# EAGLE design RSP antithept (EAGLE 7.6.0)
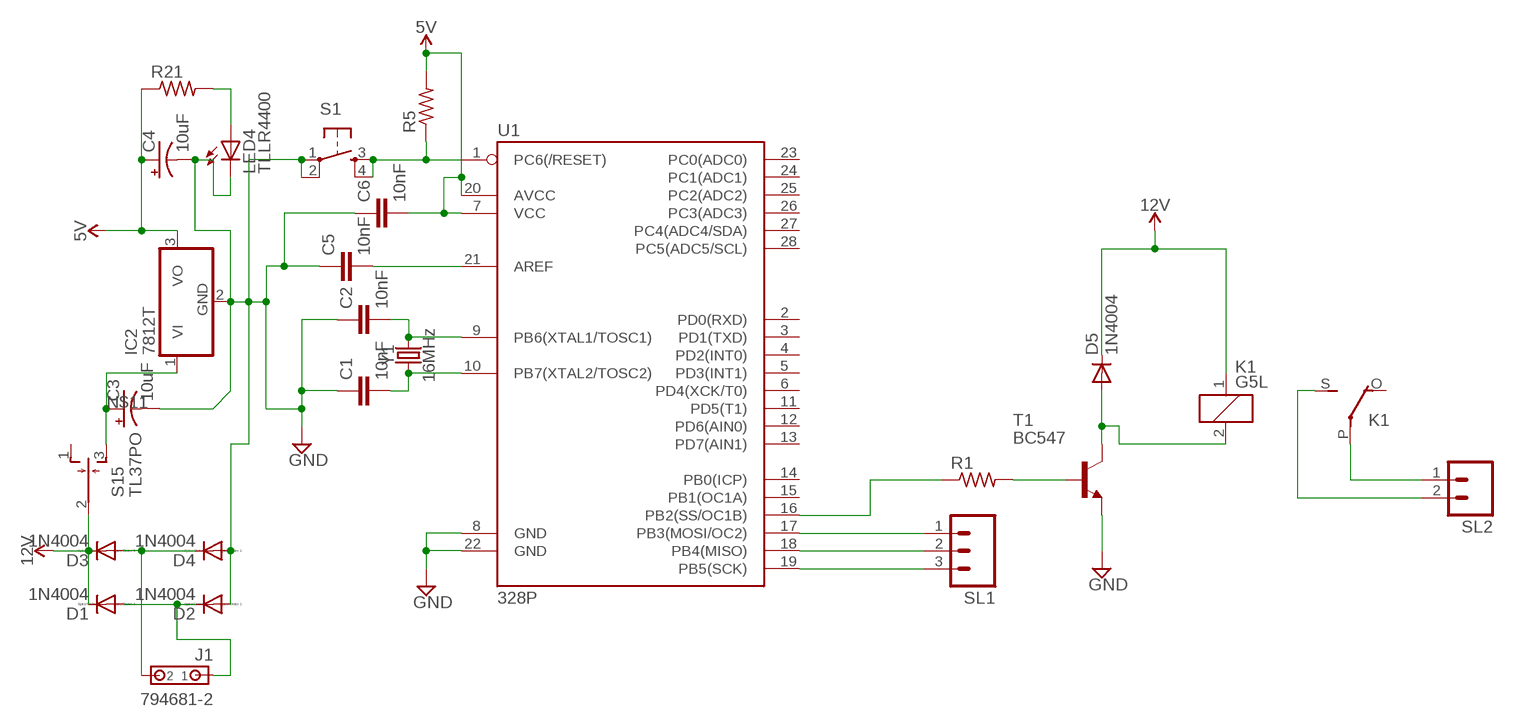
[diagram p0: schematic, sheet 1]

## Parts
C1  10nF  10NF-PTH-10MM-10000V-1-%  [CAP-PTH-10MM]
C2  10nF  10NF-PTH-10MM-10000V-1-%  [CAP-PTH-10MM]
C3  10uF  10UF-POLAR-RADIAL-2.5MM-KIT-25V-20%  [CPOL-RADIAL-2.5MM-5MM-KIT]
C4  10uF  10UF-POLAR-RADIAL-2.5MM-KIT-25V-20%  [CPOL-RADIAL-2.5MM-5MM-KIT]
C5  10nF  10NF-PTH-10MM-10000V-1-%  [CAP-PTH-10MM]
C6  10nF  10NF-PTH-10MM-10000V-1-%  [CAP-PTH-10MM]
D1  1N4004  [DO41-10]
D2  1N4004  [DO41-10]
D3  1N4004  [DO41-10]
D4  1N4004  [DO41-10]
D5  1N4004  [DO41-10]
IC2  7812T  [TO220H]
J1  794681-2  [794681-2]
K1  G5L  [G5LE]
LED4  TLLR4400  [LED3MM]
R1  R-US_0207/9  [0207/9]
R5  R-US_0207/12  [0207/12]
R21  R-US_0207/12  [0207/12]
S1  TAC_SWITCHPTH  [TACTILE-PTH]
S15  TL37PO  [TL3XPO]
SL1  MA03  [03P]
SL2  MA02  [02PA]
T1  BC547  [TO92]
U1  328P  ATMEGA328P_PDIP  [DIP28]
Y1  16MHz  CRYSTAL-16MHZPTH-HC49US  [HC49US]

## Nets
5V: C4.1(+) C6.2 IC2.3(VO) R5.2 R21.1 U1.7(VCC) U1.20(AVCC)
12V: D1.C D3.C D5.C K1.1 S15.2(P)
GND: C1.1 C2.1 C3.2(-) C4.2(-) C5.1 C6.1 D2.A D4.A IC2.2(GND) LED4.K(C) S1.1 S1.2 T1.1(E) U1.8(GND) U1.22(GND)
N$1: SL1.1 U1.17(PB3(MOSI/OC2))
N$2: SL1.2 U1.18(PB4(MISO))
N$3: C2.2 U1.9(PB6(XTAL1/TOSC1)) Y1.2
N$4: C1.2 U1.10(PB7(XTAL2/TOSC2)) Y1.1
N$5: LED4.A R21.2
N$6: C5.2 U1.21(AREF)
N$7: SL1.3 U1.19(PB5(SCK))
N$8: R1.1 U1.16(PB2(SS/OC1B))
N$9: R5.1 S1.3 S1.4 U1.1(PC6(/RESET))
N$10: D3.A D4.C J1.2
N$11: C3.1(+) IC2.1(VI) S15.3(S)
N$12: R1.2 T1.2(B)
N$13: D5.A K1.2 T1.3(C)
N$14: K1.S(2:S) SL2.2
N$15: K1.P(2:P) SL2.1
N$50: D1.A D2.C J1.1
Unconnected: K1.O(2:O) S15.1(O) U1.2(PD0(RXD)) U1.3(PD1(TXD)) U1.4(PD2(INT0)) U1.5(PD3(INT1)) U1.6(PD4(XCK/T0)) U1.11(PD5(T1)) U1.12(PD6(AIN0)) U1.13(PD7(AIN1)) U1.14(PB0(ICP)) U1.15(PB1(OC1A)) U1.23(PC0(ADC0)) U1.24(PC1(ADC1)) U1.25(PC2(ADC2)) U1.26(PC3(ADC3)) U1.27(PC4(ADC4/SDA)) U1.28(PC5(ADC5/SCL))

## Library data of the parts
C1 C2 C5 C6 = SparkFun-Capacitors:10NF: 0.01uF/10nF/10,000pF ceramic capacitors A capacitor is a passive two-terminal electrical component used to store electrical energy temporarily in an electric field. CAP-09321; PROD_ID: CAP-09321
C3 C4 = SparkFun-Capacitors:10UF-POLAR: 10.0µF polarized capacitors A capacitor is a passive two-terminal electrical component used to store electrical energy temporarily in an electric field.; PROD_ID: CAP-08440
D1-D4 = diode:1N4004: DIODE general purpose rectifier, 1 A
D5 = diode-1:1N4004: DIODE general purpose rectifier, 1 A
IC2 = linear:78*: Positive VOLTAGE REGULATOR Source: http://cache.national.com/ds/LM/LM78L05.pdf http://www.fairchildsemi.com/ds/LM/LM7805.pdf
J1 = con-amp:794681-2: Micro MATE-N-LOK Connectors grid 1.5mm Dual Row Through Hole Vertical Metal Through Hole Holddowns Source: ENG_CD_794681_E.pdf
K1 = relay:G5L: RELAY 1 x switch, 10 A/120 V AC, 8 A/30 V ADC, Omron; OC_FARNELL: unknown; OC_NEWARK: unknown
LED4 = led:TLLR4400: Low Current (2mA) LED 3 mm Tinted Diffused Package color RED Source: Data sheet <http://www.farnell.com/datasheets/391100.pdf>; MF: VISHAY SEMICONDUCTOR; OC_FARNELL: 1612437
R1 = adafruit:R-US_: RESISTOR, American symbol
R5 R21 = rcl:R-US_: RESISTOR, American symbol
S1 = SparkFun-Retired:TAC_SWITCH: Momentary Switch Button commonly used for reset or general input. Spark Fun Electronics SKU : COM-00097 SMT- SWCH-08247
S15 = switch:TL37PO: TINY SWITCH MOM OFF MOM Source: http://www2.produktinfo.conrad.com/datenblaetter/700000-724999/705152-da-01-de-Subminiaturschalter_TL_36YO.pdf
SL1 = con-amp-quick:MA03: AMP QUICK CONNECTOR; OC_FARNELL: unknown; OC_NEWARK: unknown
SL2 = con-amp-quick:MA02: AMP QUICK CONNECTOR; OC_FARNELL: unknown; OC_NEWARK: unknown
T1 = transistor:BC547: NPN TRANSISTOR
U1 = SparkFun-IC-Microcontroller:ATMEGA328P_PDIP: Atmel 328P Through hole ATMEGA328P uC used in the Arduino 32kb flash, 1k EEPROM, 2k SRAM Datasheet <http://www.sparkfun.com/datasheets/Components/SMD/ATMega328.pdf> SparkFun Products Storefront component: AVR 28 Pin 20MHz 32K 6A/D - ATMega328P <https://www.sparkfun.com/products/9061> (COM-09061) SparkFun Simon Says - Through-Hole Soldering Kit <https://www.sparkfun.com/products/10547> (KIT-10547) SparkFun Learn to Solder - Simon Says <https://www.sparkfun.com/products/13708> (KIT-13708) SparkFun BigTime Watch Kit <https://www.sparkfun.com/products/11734> (KIT-11734) SparkFun ClockIt <https://www.sparkfun.com/products/10930> (KIT-10930) SparkFun Serial Enabled LCD Kit <https://www.sparkfun.com/products/10097> (LCD-10097) SparkFun Simon Tilts - Through Hole Soldering Kit <https://www.sparkfun.com/products/12634> (KIT-12634) SparkFun Frequency Counter Kit <https://www.sparkfun.com/products/10140> (KIT-10140) FabFM Radio Kit <https://www.sparkfun.com/products/11043> (KIT-11043) SparkFun Binary Blaster Kit <https://www.sparkfun.com/products/12037> (KIT-12037) SparkFun Metro-Gnome <https://www.sparkfun.com/products/9236> (KIT-09236) ATmega328 with Arduino Optiboot (Uno) <https://www.sparkfun.com/products/10524> (DEV-10524); PROD_ID: IC-09136
Y1 = SparkFun-Clocks:CRYSTAL-16MHZ: 16MHz Crystal Digikey Example <http://www.digikey.com/product-search/en?keywords=535-9122-1-ND> Frequency: 16MHz Frequency Stability: ±50ppm Frequency Tolerance: ±20ppm Load Capacitance: 18pF SparkFun Products: Pro Micro -5V/16MHz <https://www.sparkfun.com/products/12640> SparkFun Serial Enabled LCD Kit <https://www.sparkfun.com/products/10097>; PROD_ID: XTAL-08181; SF_ID: COM-00536

## Board
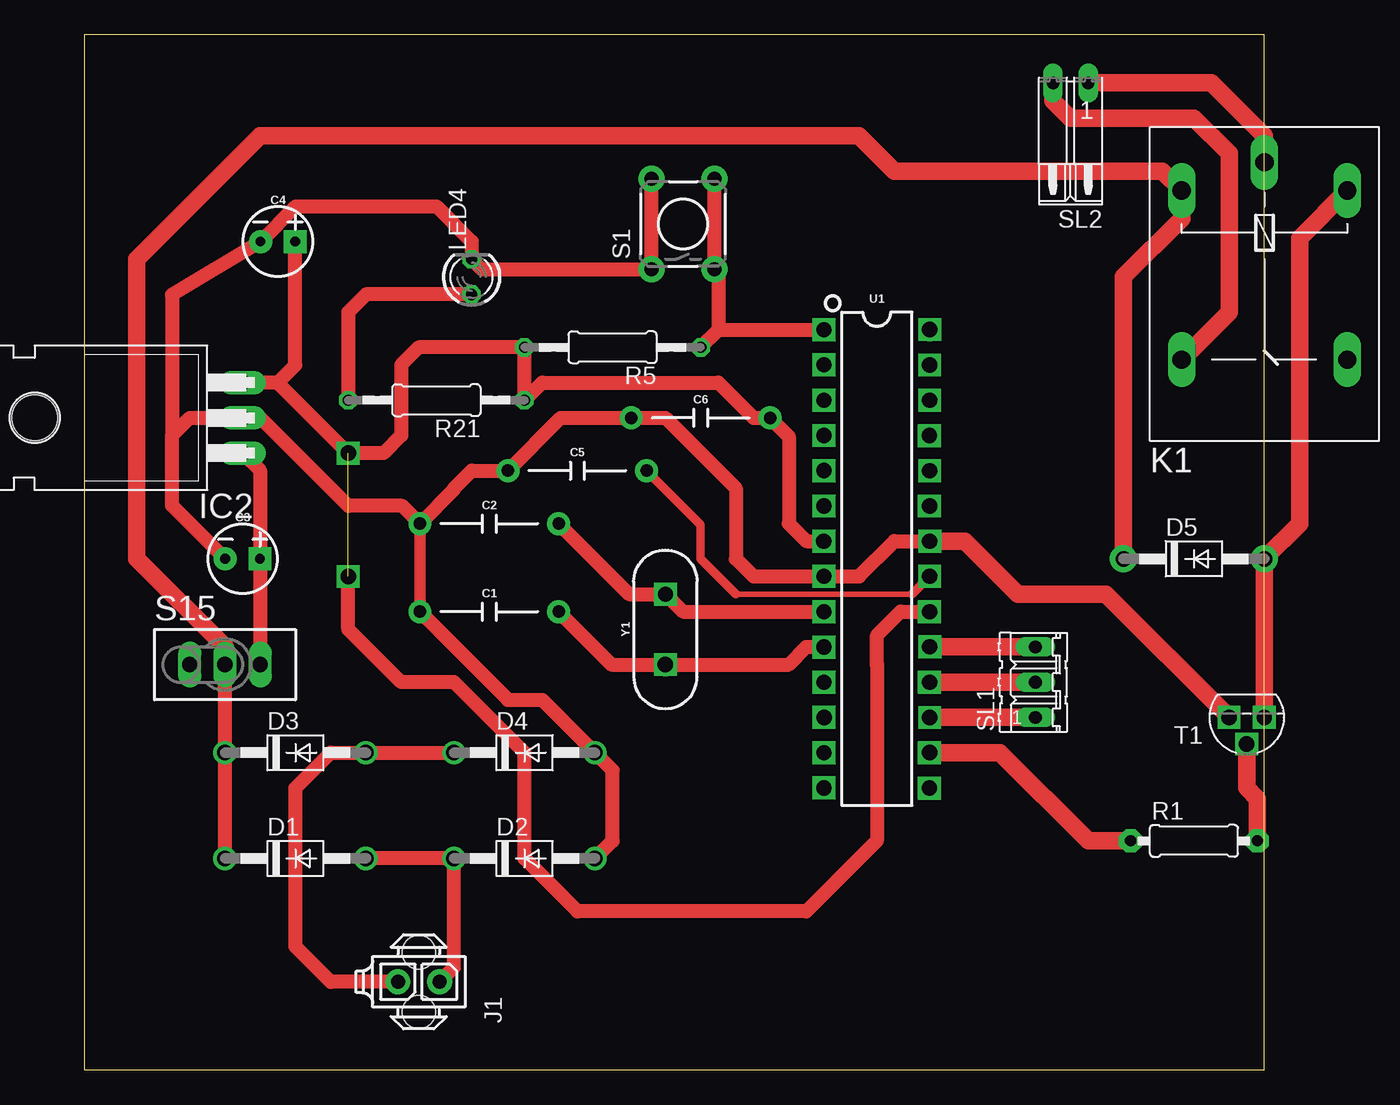
[diagram p1: board, top side]

Size 85.07 x 74.6 mm. Coordinates in mm from the lower left corner, seen from the top.
Outline: 0,0 85.07,0 85.07,74.6 0,74.6 0,0
Copper layers (1*16): Top 0.035mm / dielectric 1.5mm / Bottom 0.035mm
Design rules "default": minimum track width 10mil, minimum drill 24mil, track to track 8mil, track to pad 8mil, pad to pad 8mil, via to via 8mil, smd to smd 8mil, copper to edge 40mil, drill to drill 8mil, minimum pad ring 10mil, minimum via ring 8mil, stop-mask expansion 4mil, vias tented up to drill 0mil, thermal gap 10mil

### Footprints (pad centres in the part's own frame; a part is rotated, then mirrored left to right if it is on the bottom)
CAP-PTH-10MM = drill 0.9 pad 1.651: 1 -5,0; 2 5,0
CPOL-RADIAL-2.5MM-5MM-KIT = drill 0.7 pad 1.651 square: 1 1.25,0 | drill 0.7 pad 1.651: 2 -1.25,0
DO41-10 = drill 1.118: A 5.08,0; C -5.08,0
DO41-10' = drill 1.118 pad 1.93: A 5.08,0; C -5.08,0
TO220H = drill 1.118 long: 1 -2.54,-10.16; 2 0,-10.16; 3 2.54,-10.16 | hole 3.302: 0,4.826
794681-2 = drill 1 pad 1.778: 1 0,-1.5; 2 0,1.5 | hole 2.4: 2.13,0; -2.17,0
G5LE = drill 1.321 long: 1 -7.493,-5.969; 2 -7.493,5.969; O 4.699,5.969; P -9.525,0; S 4.699,-5.969
LED3MM = drill 0.813 octagon: A -1.27,0; K 1.27,0
0207/9 = drill 0.813 pad 1.676 octagon: 1 -4.572,0; 2 4.572,0
0207/12 = drill 0.813 octagon: 1 -6.35,0; 2 6.35,0
TACTILE-PTH = drill 1.016 pad 1.88: 1 -3.251,2.261; 2 3.251,2.261; 3 -3.251,-2.261; 4 3.251,-2.261
TL3XPO = drill 1.1 pad 1.422 long: 1 -2.54,0; 2 0,0; 3 2.54,0
03P = drill 0.914 long: 1 -2.54,0; 2 0,0; 3 2.54,0
02PA = drill 0.914 long: 1 -1.27,0; 2 1.27,0
TO92 = drill 0.813 octagon: 1 1.27,0; 2 0,1.905; 3 -1.27,0
DIP28 = drill 0.813 pad 1.626: 1 -16.51,-3.81; 2 -13.97,-3.81; 3 -11.43,-3.81; 4 -8.89,-3.81; 5 -6.35,-3.81; 6 -3.81,-3.81; 7 -1.27,-3.81; 8 1.27,-3.81; 9 3.81,-3.81; 10 6.35,-3.81; 11 8.89,-3.81; 12 11.43,-3.81; 13 13.97,-3.81; 14 16.51,-3.81; 15 16.51,3.81; 16 13.97,3.81; 17 11.43,3.81; 18 8.89,3.81; 19 6.35,3.81; 20 3.81,3.81; 21 1.27,3.81; 22 -1.27,3.81; 23 -3.81,3.81; 24 -6.35,3.81; 25 -8.89,3.81; 26 -11.43,3.81; 27 -13.97,3.81; 28 -16.51,3.81
HC49US = drill 0.7 pad 1.651: 1 -2.54,0; 2 2.54,0

### Placement (x,y rotation side)
C1  29.21,33.02 0 top
C2  29.21,39.37 0 top
C3  11.43,36.83 0 top
C4  13.97,59.69 0 top
C5  35.56,43.18 0 top
C6  44.45,46.99 0 top
D1  15.24,15.24 0 top
D2  31.75,15.24 0 top
D3  15.24,22.86 0 top
D4  31.75,22.86 0 top
D5  1N4004  [DO41-10']  80.01,36.83 0 top
IC2  1.27,46.99 90 top
J1  24.13,6.35 90 top
K1  85.09,55.88 270 top
LED4  27.94,57.15 90 top
R1  80.01,16.51 0 top
R5  38.1,52.07 180 top
R21  25.4,48.26 180 top
S1  43.18,60.96 90 top
S15  10.16,29.21 0 top
SL1  68.58,27.94 90 top
SL2  71.12,71.12 180 top
T1  83.82,25.4 180 top
U1  57.15,36.83 270 top
Y1  41.91,31.75 90 top

### Tracks (layer width: path | path; a pad name or v marks a point on that pad's centre or on a via)
5V  (via drill 1.1)  (1 unrouted)
  Top 1.016: U1.7 52.07,38.1 50.8,39.37 50.8,45.64 C6.2 48.26,46.99 45.72,49.53 33.02,49.53 R21.1 R5.2 24.13,52.07 22.86,50.8 22.86,45.72 21.59,44.45 v19.05,44.45 13.97,49.53 | 13.97,49.53 IC2.3 | 13.97,49.53 15.22,50.78 C4.1 | v19.05,35.56 19.05,31.75 22.86,27.94 26.67,27.94 31.75,22.86 31.75,15.24 35.56,11.43 52.07,11.43 57.15,16.51 57.15,29.21 57.16,29.22 57.16,31.32 58.86,33.02 U1.20
12V
  Top 1.016: D1.C D3.C S15.2
  Top 1.27: D5.C 74.93,57.15 79.12,61.34 K1.1 77.72,64.77 58.42,64.77 55.88,67.31 12.7,67.31 3.81,58.42 3.81,36.83 10.16,30.48 S15.2
GND
  Top 0.813: C1.1 C2.1
  Top 1.016: C3.2 6.35,40.66 6.35,45.72 | 6.35,45.72 7.62,46.99 IC2.2 12.7,46.99 19.05,40.64 22.94,40.64 C2.1 26.67,41.83 26.67,41.91 27.94,43.18 C5.1 34.37,46.99 C6.1 41.91,46.99 46.99,41.91 46.99,36.83 48.26,35.56 U1.8 55.88,35.56 58.42,38.1 U1.22 | 6.35,45.72 6.35,55.86 C4.2 15.26,62.23 25.4,62.23 27.94,59.69 LED4.K 28.65,57.71 S1.1 S1.2 | D2.A 38.1,16.51 38.1,21.59 D4.A 33.02,26.67 30.56,26.67 C1.1
  Top 1.27: T1.1 73.66,34.29 67.31,34.29 63.5,38.1 U1.22
N$1
  Top 1.27: U1.17 SL1.1
N$2
  Top 1.27: SL1.2 U1.18
N$3
  Top 1.016: C2.2 39.29,34.29 Y1.2 43.18,33.02 U1.9
N$4
  Top 1.016: U1.10 52.07,30.48 50.8,29.21 Y1.1 38.02,29.21 C1.2
N$5
  Top 1.016: LED4.A 20.32,55.88 19.05,54.61 R21.2
N$6
  Top 0.406: 46.99,34.29 59.69,34.29
  Top 0.61: C5.2 44.45,39.29 44.45,36.83 46.99,34.29 | 59.69,34.29 U1.21
N$7
  Top 1.27: U1.19 SL1.3
N$8
  Top 1.27: U1.16 66.04,22.86 72.39,16.51 R1.1
N$9
  Top 1.016: S1.4 S1.3 45.72,57.43 45.72,53.34 | R5.1 45.72,53.34 | 45.72,53.34 U1.1
N$10
  Top 1.016: J1.2 17.78,6.35 15.24,8.89 15.24,20.32 17.78,22.86 D3.A D4.C
N$11
  Top 1.016: S15.3 12.7,36.81 C3.1 12.68,43.2 IC2.1
N$12
  Top 1.27: T1.2 83.82,20.32 84.58,19.56 R1.2
N$13
  Top 1.27: K1.2 87.63,59.94 87.63,39.37 D5.A T1.3
N$14
  Top 1.27: SL2.2 69.85,69.85 71.12,68.58 80.01,68.58 82.55,66.04 82.55,54.61 K1.S
N$15
  Top 1.27: SL2.1 81.28,71.12 85.09,67.31 K1.P
N$16  (via drill 1.1)
  other vias: 53.35,53.34
N$17  (via drill 1.1)
  other vias: 53.34,50.81
N$18  (via drill 1.1)
  other vias: 53.34,48.26
N$19  (via drill 1.1)
  other vias: 53.34,45.72
N$20  (via drill 1.1)
  other vias: 53.35,43.19
N$21  (via drill 1.1)
  other vias: 53.35,40.64
N$22  (via drill 1.1)
  other vias: 53.33,38.09
N$23  (via drill 1.1)
  other vias: 53.35,35.57
N$24  (via drill 1.1)
  other vias: 53.34,33.02
N$25  (via drill 1.1)
  other vias: 53.33,30.47
N$26  (via drill 1.1)
  other vias: 53.34,27.94
N$27  (via drill 1.1)
  other vias: 53.35,25.4
N$28  (via drill 1.1)
  other vias: 53.33,22.85
N$29  (via drill 1.1)
  other vias: 53.34,20.32
N$30  (via drill 1.1)
  other vias: 60.95,20.31
N$31  (via drill 1.1)
  other vias: 60.95,22.87
N$32  (via drill 1.1)
  other vias: 60.96,25.39
N$33  (via drill 1.1)
  other vias: 60.95,27.94
N$34  (via drill 1.1)
  other vias: 60.97,30.49
N$35  (via drill 1.1)
  other vias: 60.96,33.03
N$36  (via drill 1.1)
  other vias: 60.96,35.57
N$37  (via drill 1.1)
  other vias: 60.97,38.09
N$38  (via drill 1.1)
  other vias: 60.96,40.64
N$39  (via drill 1.1)
  other vias: 60.96,43.17
N$40  (via drill 1.1)
  other vias: 60.95,45.71
N$41  (via drill 1.1)
  other vias: 60.96,48.27
N$42  (via drill 1.1)
  other vias: 60.96,50.8
N$43  (via drill 1.1)
  other vias: 60.96,53.35
N$44  (via drill 1.1)
  other vias: 82.54,25.4
N$45  (via drill 1.1)
  other vias: 83.81,23.48
N$46  (via drill 1.1)
  other vias: 85.08,25.4
N$47  (via drill 1.1)
  other vias: 41.91,29.22
N$48  (via drill 1.1)
  other vias: 41.91,34.27
N$50
  Top 1.016: J1.1 26.67,7.39 D2.C D1.A